# Altium project sonata-board.PrjPcb (part 2 of 2)

## Sheet sb-sonata-psu.SchDoc: Switch-mode PSU
size Letter; Organization: NewAE Technology Inc.; Address1: 1083 Queen St., Suite 196; Address2: Halifax; Address3: NS; Address4: Canada B3H 0B2; SheetNumber: 18; SheetTotal: 22; SheetApproved: YES
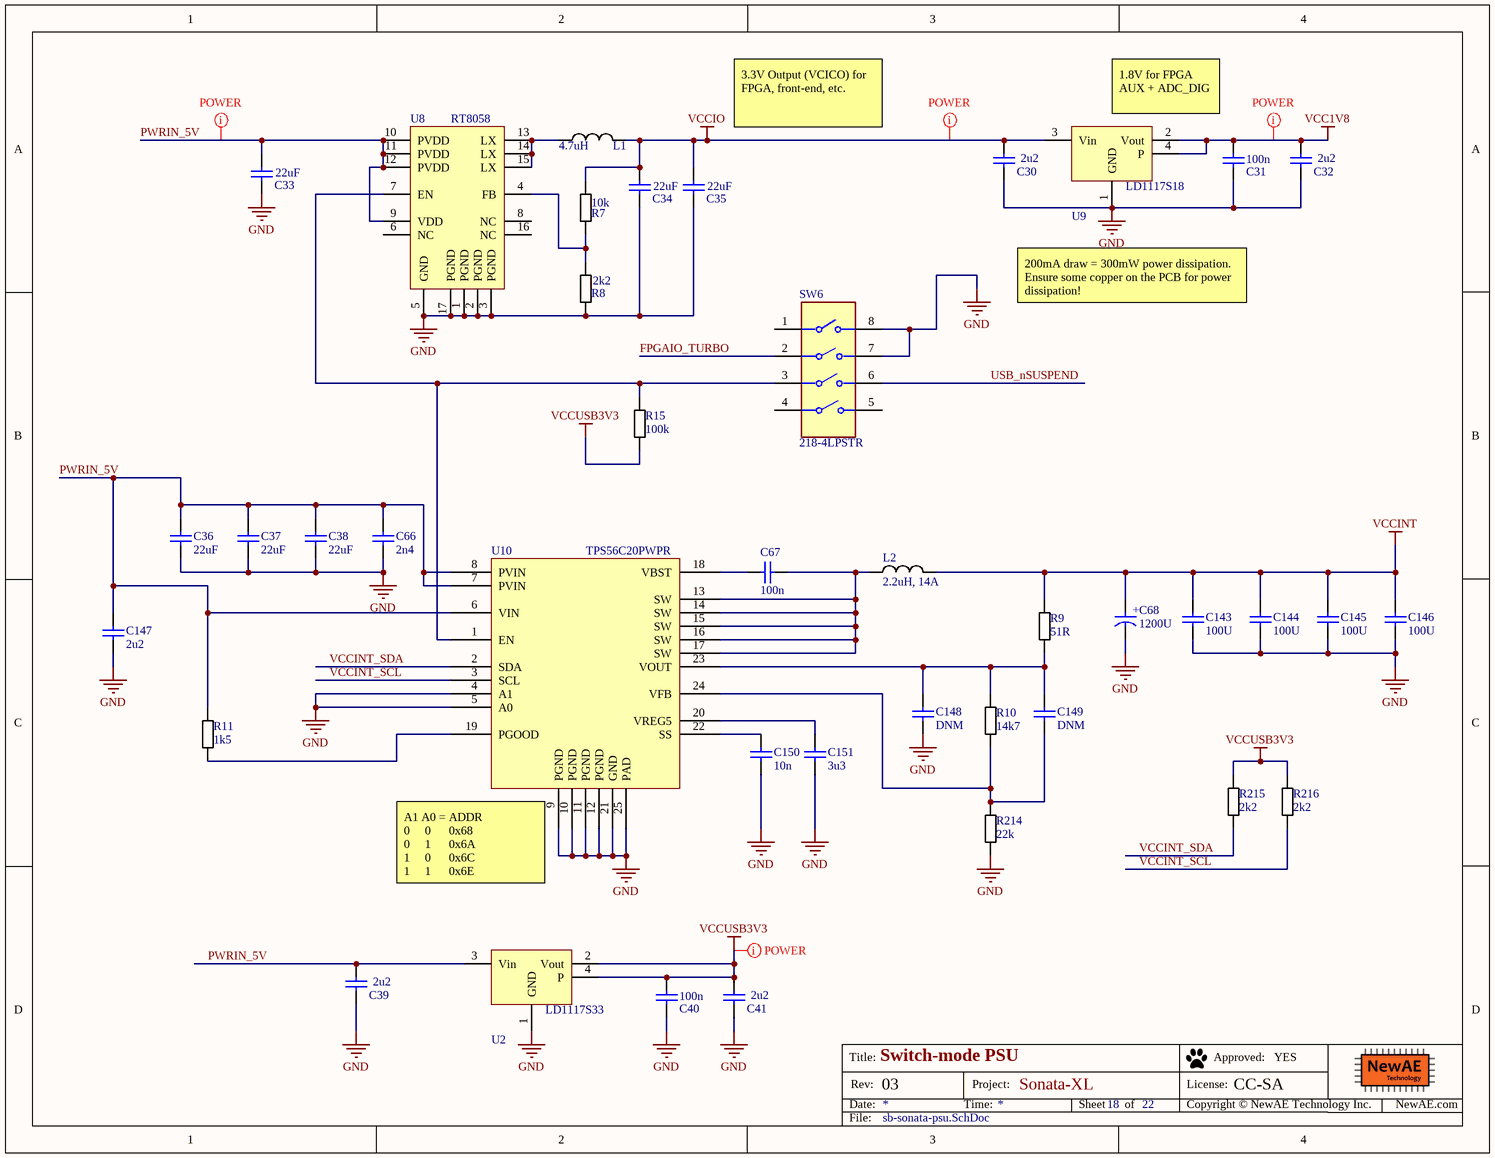
[diagram p6: sb-sonata-psu.SchDoc]

### Parts
C30  2u2  [CAPC0603_M]
C31  100n  [CAPC0402_M]
C32  2u2  [CAPC0603_M]
C33  22uF  [CAPC0805_M]
C34  22uF  [CAPC0805_M]
C35  22uF  [CAPC0805_M]
C36  22uF  [CAPC0805_M]
C37  22uF  [CAPC0805_M]
C38  22uF  [CAPC0805_M]
C39  2u2  [CAPC0603_M]
C40  100n  [CAPC0402_M]
C41  2u2  [CAPC0603_M]
C66  2n4  [RESC1608X55N]
C67  100n  [CAPC0603_M]
C68  1200U  [PAN_C10_POS1_NEG2]
C143  100U  [CAPC1206_M]
C144  100U  [CAPC1206_M]
C145  100U  [CAPC1206_M]
C146  100U  [CAPC1206_M]
C147  2u2  [CAPC0603_M]
C148  DNM  [CAPC0402_M]
C149  DNM  [CAPC0402_M]
C150  10n  [CAPC0603_M]
C151  3u3  [CAPC0603_M]
L1  4.7uH  [NR6028]
L2  2.2uH, 14A  [XAL1060-222]
R7  10k  [RESC1005X40N]
R8  2k2  [RESC1005X40N]
R9  51R  [RESC1608X55N]
R10  14k7  [RESC1005X40N]
R11  1k5  [RESC1608X55N]
R15  100k  [RESC1608X55N]
R214  22k  [RESC1005X40N]
R215  2k2  [RESC1005X40N]
R216  2k2  [RESC1005X40N]
SW6  218-4LPSTR  [FP-218-4LPSTR-MFG]
U2  LD1117S33  [SOT-223]
U8  RT8058  [QFN16_50P300X300X100_HS-17M]
U9  LD1117S18  [SOT-223]
U10  TPS56C20PWPR  [R-PDSO-G24]

### Nets
GND: C30.2 C31.2 C32.2 C33.2 C34.2 C35.2 C36.2 C37.2 C38.2 C39.2 C40.2 C41.2 C66.2 C68.2 C143.2 C144.2 C145.2 C146.2 C147.2 C148.2 C150.2 C151.2 R8.2 R214.2 SW6.7 SW6.8 U2.1(GND) U8.1(PGND) U8.2(PGND) U8.3(PGND) U8.5(GND) U8.17(PGND) U9.1(GND) U10.4(A1) U10.5(A0) U10.9(PGND) U10.10(PGND) U10.11(PGND) U10.12(PGND) U10.21(GND) U10.25(PAD)
VCC1V8: C31.1 C32.1 U9.2(Vout) U9.4(P)
VCCINT: C68.1 C143.1 C144.1 C145.1 C146.1 L2.2 R9.1
VCCIO: C30.1 C34.1 C35.1 L1.2 R7.1 U9.3(Vin)  [project net 3V3_FTDI]
VCCUSB3V3: C40.1 C41.1 R15.1 R215.1 R216.1 U2.2(Vout) U2.4(P)
FPGAIO_TURBO: SW6.2
PWRIN_5V: C33.1 C36.1 C37.1 C38.1 C39.1 C66.1 C147.1 R11.2 U2.3(Vin) U8.9(VDD) U8.10(PVDD) U8.11(PVDD) U8.12(PVDD) U10.6(VIN) U10.7(PVIN) U10.8(PVIN)
USB_nSUSPEND: SW6.6
VCCINT_SCL: R216.2 U10.3(SCL)
VCCINT_SDA: R215.2 U10.2(SDA)
NetC67_1: C67.1 U10.18(VBST)
NetC67_2: C67.2 L2.1 U10.13(SW) U10.14(SW) U10.15(SW) U10.16(SW) U10.17(SW)
NetC148_1: C148.1 C149.1 R9.2 R10.1 U10.23(VOUT)
NetC149_2: C149.2 R10.2 R214.1 U10.24(VFB)
NetC150_1: C150.1 U10.22(SS)
NetC151_1: C151.1 U10.20(VREG5)
NetL1_1: L1.1 U8.13(LX) U8.14(LX) U8.15(LX)
NetR7_2: R7.2 R8.1 U8.4(FB)
NetR11_1: R11.1 U10.19(PGOOD)
NetR15_2: R15.2 SW6.3 U8.7(EN) U10.1(EN)

Not connected (* = marked no-connect by the designer): SW6 1 4 5; U8 6(NC) 8(NC) 16(NC)

### Layout directives
net class Power: 3V3_FTDI, PWRIN_5V, VCC1V8, VCCUSB3V3

### Notes on the sheet
- 3.3V Output (VCICO) for FPGA, front-end, etc.
- 1.8V for FPGA AUX + ADC_DIG
- 200mA draw = 300mW power dissipation. Ensure some copper on the PCB for power dissipation!
- (near U10) A1 A0 = ADDR
  0     0      0x68
  0     1      0x6A
  1     0      0x6C
  1     1      0x6E
- Title:
- Date:
- Rev:
- Time:
- Project:
- Sheet
- of
- License:
- Copyright © NewAE Technology Inc.
- Approved:
- NewAE.com
- File:
- (in symbol 2SVPE1200M) +

### Library data of the parts
C30 C32 C39 C41 = CCHIP-2u2-0603: 2u2, 0603; Manufacture 1: Samsung; Manufacture Part Number 1: CL10B225KP8NNNC; Component Group: Capacitor; Case-EIA: 0603; Case-Metric: 1608; Rated Voltage: 10VDC; Part Number: CCHIP-2u2-0603; Footprint: 0603; Pin Count: 2; Supplier 1: Digi-Key; Supplier Part Number 1: 1276-1134-2-ND; Value: 2u2; Mounting Technology: SMT; Component Kind: Standard; Component Type: Standard
C31 C40 = CCHIP-100n-0402: 100n, 0402; Component Group: Capacitor; Case-EIA: 0402; Part Number: CCHIP-100n-0402; Footprint: 0402; Pin Count: 2; Value: 100n; Mounting Technology: SMT; Component Kind: Standard; Component Type: Standard; Supplier 1: Digi-Key; Supplier Part Number 1: 445-6901-1-ND
C33-C38 = CCHIP-22u-0805-16V: 22u, 16V, 0805, Ceramic; Manufacture 1: Samsung Electro-Mechanics; Manufacture Part Number 1: CL21A226MOCLRNC; Component Group: Capacitor; Case-EIA: 0805; Case-Metric: 1608; Rated Voltage: 16VDC; Tolerance: 20%; Part Number: CCHIP-22u-0805-16V; Footprint: 0805; Pin Count: 2; Supplier 1: Digi-Key; Supplier Part Number 1: 1276-6780-1-ND; Value: 22uF; Mounting Technology: SMT; RoHS: Yes; Component Kind: Standard; Component Type: Standard
C66 = CCHIP-2N4-0603-50V: CAP CER 2400PF 50V C0G/NP0 0603; Manufacture 1: Murata Electronics North America; Manufacture Part Number 1: GRM1885C1H242JA01D; Component Group: Capacitor; Case-EIA: 0603; Case-Metric: 1608; Tolerance: ±5%; PP Material Stack: 0; Part Number: CCHIP-2N4-0603-50V; Footprint: 0603; Pin Count: 2; Supplier 1: Digi-Key; Supplier Part Number 1: 490-3282-1-ND; Value: 2n4; Rated Voltage: 50V; Mounting Technology: SMT; Component Kind: Standard; Component Type: Standard; PP Rotation: 0
C67 = CCHIP-100n-0603: 100n, 0603; Manufacture 1: Kemet; Manufacture Part Number 1: C0603C104K5RACTU; Component Group: Capacitor; Case-EIA: 0603; Case-Metric: 1608; Rated Voltage: 50VDC; Part Number: CCHIP-100n-0603; Footprint: 0603; Pin Count: 2; Supplier 1: Digi-Key; Supplier Part Number 1: 399-5089-2-ND; Value: 100n; Mounting Technology: SMT; Component Kind: Standard; Component Type: Standard
C68 = 2SVPE1200M: CAP ALUM POLY 1200UF 2.5V SMD; Manufacture 1: Panasonic Electronic Components; Component Group: Capacitor; PP Material Stack: 0; Part Number: 2SVPE1200M; Footprint: SMD 6.3 PAN_C10; Manufacture Part Number 1: 2SVPE1200M; Pin Count: 2; Supplier 1: Digi-Key; Supplier Part Number 1: P16556TR-ND; Value: 1200U; Mounting Technology: SMT; Component Kind: Standard; Component Type: Standard; PP Rotation: 0
C143-C146 = CCHIP-100u-1206: CAP CER 100UF 6.3V X5R 1206; Manufacture 1: Murata Electronics; Manufacture Part Number 1: GRM31CR60J107ME39L; Component Group: Capacitor; Case-EIA: 1206; Case-Metric: 3216; Rated Voltage: 6.3VDC; Part Number: CCHIP-100u-1206; Footprint: 1206; Pin Count: 2; Supplier 1: Digi-Key; Supplier Part Number 1: 490-4539-2-ND; Value: 100U; Mounting Technology: SMT; Component Kind: Standard; Component Type: Standard
C147 = CCHIP-2u2-0603-25V: 2u2, 0603; Manufacture 1: Murata Electronics North America; Manufacture Part Number 1: GRM188R61E225MA12D; Component Group: Capacitor; Case-EIA: 0603; Case-Metric: 1608; Rated Voltage: 25VDC; Tolerance: ±20%; Part Number: CCHIP-2u2-0603-25V; Footprint: 0603; Pin Count: 2; Supplier 1: Digi-Key; Supplier Part Number 1: 490-12738-1-ND; Value: 2u2; Mounting Technology: SMT; RoHS: Yes; Component Kind: Standard; Component Type: Standard
C148 C149 = CCHIP-DNM-0402: DNM, 0402; Component Group: Capacitor; Case-EIA: 0402; Part Number: CCHIP-DNM-0402; Footprint: 0402; Pin Count: 2; Value: DNM; Mounting Technology: SMT; Component Kind: Standard; Component Type: Standard
C150 = CCHIP-10n-0603: 10n, 0603; Component Group: Capacitor; Case-EIA: 0603; Case-Metric: 1608; Part Number: CCHIP-10n-0603; Footprint: 0603; Pin Count: 2; Supplier 1: Digi-Key; Supplier Part Number 1: 399-1091-1-ND; Value: 10n; Mounting Technology: SMT; Component Kind: Standard; Component Type: Standard
C151 = CCHIP-3u3-0603: 3u3, 0603; Manufacture 1: Samsung; Manufacture Part Number 1: CL10B335KP8NNNC; Component Group: Capacitor; Case-EIA: 0603; Case-Metric: 1608; Rated Voltage: 10VDC; Part Number: CCHIP-3u3-0603; Footprint: 0603; Pin Count: 2; Supplier 1: Digi-Key; Value: 3u3; Mounting Technology: SMT; Component Kind: Standard; Component Type: Standard; Supplier Part Number 1: 1276-2041-1-ND
L1 = NR6028T4R7M: fixed ind, ferrite, shielded; Manufacture 1: Taiyo Yuden; Component Group: Inductor; Case-Metric: 6060; Part Number: NR6028T4R7M; Footprint: SMD,6x6mm; Manufacture Part Number 1: NR6028T4R7M; Pin Count: 2; Supplier 1: Digi-Key; Supplier Part Number 1: 587-2100-1-ND; Value: 4.7uH; Mounting Technology: SMT; Component Kind: Standard; Component Type: Standard
L2 = XAL1060-222MEB: 2.2uH, 14A RMS; Manufacture 1: Coilcraft; Component Group: Inductor; PP Material Stack: 0; Part Number: XAL1060-222MEB; Footprint: XAL1060; Manufacture Part Number 1: XAL1060-222MEB; Pin Count: 2; Supplier 1: Mouser; Component Kind: Standard; Component Type: Standard; PP Rotation: 0; PP Rotation1: 0
R7 = RCHIP-10K-0402: 10k res, 0402, 1%, 1/16W; Manufacture 1: Yageo; Manufacture Part Number 1: RC0402FR-0710KL; Component Group: Resistor; Case-EIA: 0402; Case-Metric: 1005; Rated Power: 0.063W; Rated Voltage: 75VDC; Part Number: RCHIP-10K-0402; Footprint: 0402; Pin Count: 2; Supplier 1: Digi-Key; Supplier Part Number 1: 311-10.0KLRCT-ND; Value: 10k; Tolerance: 1%; Mounting Technology: SMT; Temperature Range: -55C to 155C; Component Kind: Standard; Component Type: Standard
R8 R215 R216 = RCHIP-2K2-0402: 2k2 res, 0402, 1%, 1/16W; Manufacture 1: Yageo; Manufacture Part Number 1: RC0402FR-072K2L; Component Group: Resistor; Case-EIA: 0402; Case-Metric: 1005; Rated Power: 0.063W; Rated Voltage: 75VDC; Part Number: RCHIP-2K2-0402; Footprint: 0402; Pin Count: 2; Supplier 1: Digi-Key; Supplier Part Number 1: 311-2.20KLRCT-ND; Value: 2k2; Tolerance: 1%; Mounting Technology: SMT; Temperature Range: -55C to 155C; Component Kind: Standard; Component Type: Standard
R9 = RCHIP-51R-0603: 51R res, 0603, 1%, 1/10W; Manufacture 1: Yageo; Manufacture Part Number 1: RC0603FR-0751RL; Component Group: Resistor; Case-EIA: 0603; Case-Metric: 1608; Rated Power: 0.1W; Rated Voltage: 75VDC; Part Number: RCHIP-51R-0603; Footprint: 0603; Pin Count: 2; Supplier 1: Digi-Key; Supplier Part Number 1: 311-51.0HRCT-ND; Value: 51R; Tolerance: 1%; Mounting Technology: SMT; Temperature Range: -55C to 155C; Component Kind: Standard; Component Type: Standard
R10 = RCHIP-14K7-0402: 14k7 res, 0402, 1%, 1/16W; Manufacture 1: Yageo; Manufacture Part Number 1: RC0402FR-0714K7L; Component Group: Resistor; Case-EIA: 0402; Case-Metric: 1005; Rated Power: 0.063W; Rated Voltage: 75VDC; Part Number: RCHIP-14K7-0402; Footprint: 0402; Pin Count: 2; Supplier 1: Digi-Key; Supplier Part Number 1: 311-14.7KLRCT-ND; Value: 14k7; Tolerance: 1%; Mounting Technology: SMT; Temperature Range: -55C to 155C; Component Kind: Standard; Component Type: Standard
R11 = RCHIP-1K5-0603: 1k5 res, 0603, 1%, 1/10W; Manufacture 1: Yageo; Manufacture Part Number 1: RC0603FR-071K5L; Component Group: Resistor; Case-EIA: 0603; Case-Metric: 1608; Rated Power: 0.1W; Rated Voltage: 75VDC; Part Number: RCHIP-1K5-0603; Footprint: 0603; Pin Count: 2; Supplier 1: Digi-Key; Supplier Part Number 1: 311-1.50KHRCT-ND; Value: 1k5; Tolerance: 1%; Mounting Technology: SMT; Temperature Range: -55C to 155C; Component Kind: Standard; Component Type: Standard
R15 = RCHIP-100K-0603: 100k res, 0603, 1%, 1/10W; Manufacture 1: Yageo; Manufacture Part Number 1: RC0603FR-07100KL; Component Group: Resistor; Case-EIA: 0603; Case-Metric: 1608; Rated Power: 0.1W; Rated Voltage: 75VDC; Part Number: RCHIP-100K-0603; Footprint: 0603; Pin Count: 2; Supplier 1: Digi-Key; Supplier Part Number 1: 311-100KHRCT-ND; Value: 100k; Tolerance: 1%; Mounting Technology: SMT; Temperature Range: -55C to 155C; Component Kind: Standard; Component Type: Standard
R214 = RCHIP-22K-0402: 22k res, 0402, 1%, 1/16W; Manufacture 1: Yageo; Manufacture Part Number 1: RC0402FR-0722KL; Component Group: Resistor; Case-EIA: 0402; Case-Metric: 1005; Rated Power: 0.063W; Rated Voltage: 75VDC; Part Number: RCHIP-22K-0402; Footprint: 0402; Pin Count: 2; Supplier 1: Digi-Key; Supplier Part Number 1: 311-22.0KLRCT-ND; Value: 22k; Tolerance: 1%; Mounting Technology: SMT; Temperature Range: -55C to 155C; Component Kind: Standard; Component Type: Standard
SW6 = CMP-07018-000008-1: SWITCH SLIDE DIP SPST 25MA 24V; Number of Positions: 4; Washable: Yes; Pitch: 0.05inch; Actuator Type: Slide (Standard); Electrical Life: 1000Cycles; Current Rating: 25mA; Contact Material: Copper; Max Current Rating: 25mA; Termination: Gull Wing; Throw Configuration: SPST; Mount: Surface Mount; Radiation Hardening: No; Contact Plating: Gold; Length: 0.246inch; Depth: 8.44mm; Package Quantity: 2000; Packaging: Tape and Reel; Series: 218; Lead Free: Lead Free; Voltage Rating (DC): 24V; Min Operating Temperature: -55°C; RoHS Compliant: Yes; Mechanical Life: 1000Cycles; Max Operating Temperature: 85°C; Orientation: Straight; Max Voltage Rating (DC): 24V
U2 = LD1117S33: IC REG LIN POS 3.3V 800MA SOT223; Manufacture 1: STMicroelectronics; Manufacture Part Number 1: LD1117S33TR; Component Group: Analog IC; Rated Voltage: 15V; PP Material Stack: 0; Part Number: LD1117S33; Pin Count: 3; Supplier 1: Digi-Key; Supplier Part Number 1: 497-1242-1-ND; Mounting Technology: SMT; RoHS: Yes; Component Kind: Standard; Component Type: Standard; PP Rotation: 0
U8 = RT8058: Switching supply controller, 2A; Manufacture 1: Richtek; Component Group: Analog IC; PP Material Stack: 0; Part Number: RT8058; Footprint: QFN16; Manufacture Part Number 1: RT8058; Pin Count: 17; Component Kind: Standard; Component Type: Standard; PP Rotation: 0
U9 = LD1117S18: IC REG LIN POS 1.8V 800MA SOT223; Manufacture 1: STMicroelectronics; Manufacture Part Number 1: LD1117S18TR; Component Group: Analog IC; Rated Voltage: 15V; PP Material Stack: 0; Part Number: LD1117S18; Pin Count: 3; Supplier 1: Digi-Key; Supplier Part Number 1: 497-7308-1-ND; Mounting Technology: SMT; RoHS: Yes; Component Kind: Standard; Component Type: Standard; PP Rotation: 0
U10 = TPS56C20PWPR: IC Reg Buck Adj/Prog 12A; Manufacture 1: Texas Instruments; Component Group: Analog IC; PP Material Stack: 0; Part Number: TPS56C20PWPR; Footprint: 24HTSSOP; Manufacture Part Number 1: TPS56C20PWPR; Pin Count: 25; Supplier 1: Digi-Key; Supplier Part Number 1: 296-TPS56C20PWPRCT-ND; Mounting Technology: SMT; Component Kind: Standard; Component Type: Standard; PP Rotation: 0; PP Rotation1: 0

## Nets that join several sheets
3V3_FTDI: sb-sonata-headers1 (17 pins), sb-sonata-usbrp (28 pins), sb-sonata-debug (20 pins), sb-sonata-analoginput (C100.1 L7.1), sb-sonata-psu (6 pins)
GND: sb-sonata-headers1 (20 pins), sb-sonata-usbrp (33 pins), sb-sonata-debug (45 pins), sb-sonata-fpgapwr2 (121 pins), sb-sonata-analoginput (C100.2), sb-sonata-psu (41 pins)
XADC_AGND: sb-sonata-fpgapwr2 (U4.M11), sb-sonata-analoginput (26 pins)
AH_AN0: sb-sonata-headers1 (P5.6 P6.1), sb-sonata-analoginput (R75.1 R77.1)
AH_AN1: sb-sonata-headers1 (P5.5), sb-sonata-analoginput (R83.1 R84.1)
AH_AN2: sb-sonata-headers1 (P5.4), sb-sonata-analoginput (R89.1 R91.1)
AH_AN3: sb-sonata-headers1 (P5.3), sb-sonata-analoginput (R97.1 R98.1)
AH_AN4: sb-sonata-headers1 (P5.2), sb-sonata-analoginput (R104.1 R105.1)
AH_AN5: sb-sonata-headers1 (P5.1), sb-sonata-analoginput (R111.1 R112.1)
CHC_RXD: sb-sonata-headers1 (P12.3), sb-sonata-debug (U5.39)
CHC_TXD: sb-sonata-headers1 (P12.1), sb-sonata-debug (U5.38)
CHD_RXD: sb-sonata-headers1 (P12.7), sb-sonata-debug (U5.52)
CHD_TXD: sb-sonata-headers1 (P12.5), sb-sonata-debug (U5.48)
FPGAIO_TURBO: sb-sonata-usbrp (U11.18), sb-sonata-psu (SW6.2)
NRST: sb-sonata-headers1 (P2.6), sb-sonata-usbrp (U11.28), sb-sonata-debug (J4.10 J5.15 SW2.12)
PWRIN_5V: sb-sonata-headers1 (5 pins), sb-sonata-psu (16 pins)
VCCINT_SCL: sb-sonata-usbrp (U11.30), sb-sonata-psu (R216.2 U10.3)
VCCINT_SDA: sb-sonata-usbrp (U11.29), sb-sonata-psu (R215.2 U10.2)

## Assembly variants
Variant of cheriot-test: not fitted J4